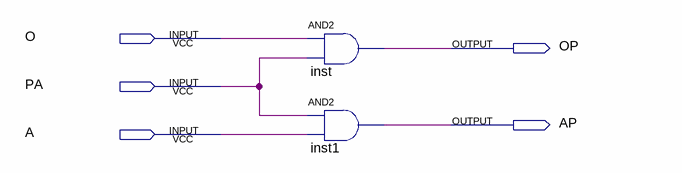
[diagram p0: schematic sheet]
// Quartus schematic Obrir_Alliberar_1_bit.bdf as structural Verilog: 2 symbols, 5 pins
module Obrir_Alliberar_1_bit (
  input  O,
  input  PA,
  input  A,
  output OP,
  output AP
);

  and inst (OP, O, PA);
  and inst1 (AP, PA, A);
endmodule
